# Altium schematic sheet E17-PDU-4-REGULATORS.SchDoc
size A4
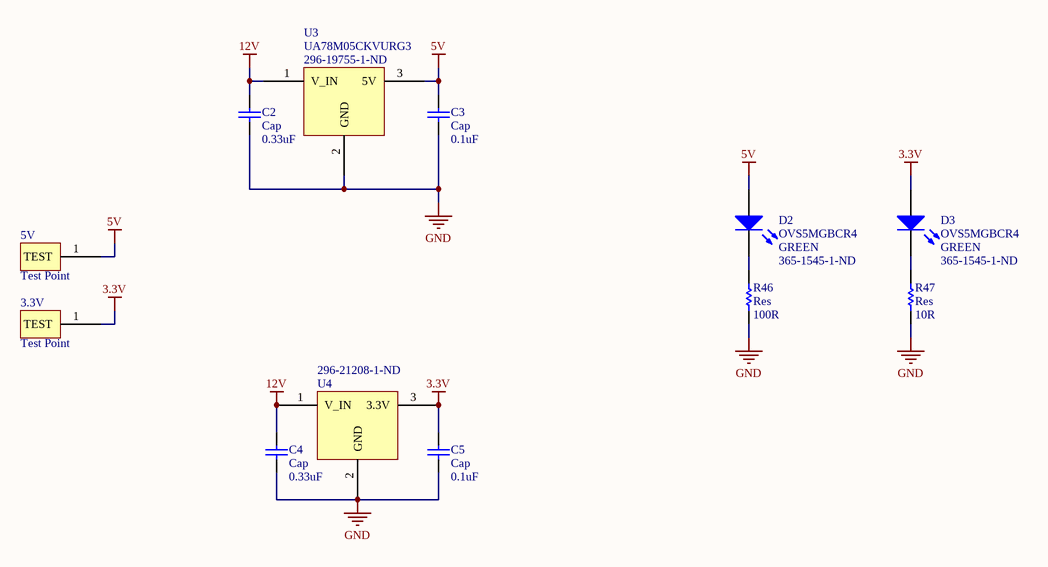
[diagram p0: E17-PDU-4-REGULATORS.SchDoc]

## Parts
3.3V  Test Point  [TEST POINT 5000K]
5V  Test Point  [TEST POINT 5000K]
C2  Cap  value 0.33uF  [C0805]
C3  Cap  value 0.1uF  [C0805]
C4  Cap  value 0.33uF  [C0805]
C5  Cap  value 0.1uF  [C0805]
D2  OVS5MGBCR4  Colour: GREEN  Supplier Part Number 1: 365-1545-1-ND  [OVS5MGBCR4]
D3  OVS5MGBCR4  Colour: GREEN  Supplier Part Number 1: 365-1545-1-ND  [OVS5MGBCR4]
R46  Res  value 100R  [2012[0805]]
R47  Res  value 10R  [2012[0805]]
U3  UA78M05CKVURG3  Supplier Part Number 1: 296-19755-1-ND  [TO-252-3]
U4  Supplier Part Number 1: 296-21208-1-ND  [TO-252-3]  (hidden comment: UA78M33CKVURG3)

## Nets
3.3V: 3.3V.1(TEST) C5.2 D3.1(A) U4.3(3.3V)
5V: 5V.1(TEST) C3.2 D2.1(A) U3.3(5V)
12V: C2.2 C4.2 U3.1(V_IN) U4.1(V_IN)
GND: C2.1 C3.1 C4.1 C5.1 R46.2 R47.2 U3.2(GND) U4.2(GND)
NetD2_2: D2.2(K) R46.1
NetD3_2: D3.2(K) R47.1

## Library data of the parts
3.3V 5V = Test Point: 5000-5004, 5015-5019 Keystone Electronics
C2-C5 = Cap: Capacitor; Published: 8-Jun-2000; LatestRevisionDate: 17-Jul-2002; LatestRevisionNote: Re-released for DXP Platform.; PackageReference: C1206; Publisher: Altium Limited
D2 D3 = OVS5MGBCR4: Typical GREEN LED; Published: 8-Jun-2000; LatestRevisionDate: 17-Jul-2002; LatestRevisionNote: Re-released for DXP Platform.; PackageDocument: Feb-2002; PackageReference: 3.2X1.6X1.1; Publisher: Altium Limited; Supplier 1: Digi-Key
R46 R47 = Res: Surface Mount Resistor; Published: 8-Jun-2000; LatestRevisionDate: 17-Jul-2002; LatestRevisionNote: Re-released for DXP Platform.; PackageReference: AXIAL-0.5; Publisher: Altium Limited
U3 = UA78M05CKVURG3: 5.0V Regulator; Supplier 1: Digi-Key
U4 = UA78M33CKVURG3: 3.3V Regulator; Supplier 1: Digi-Key